# Altium schematic sheet KS-WL-GW-GPRS.SchDoc
size A4; CheckedBy: Fan mingjie; DrawnBy: Jason Huang; Address1: Buliding 5, No.1528; Address2: Gu Mei Rd HQ6; Address3: Shanghai, China; Address4: 20233; DocumentNumber: 1; Revision: 1; SheetNumber: 1; SheetTotal: 2
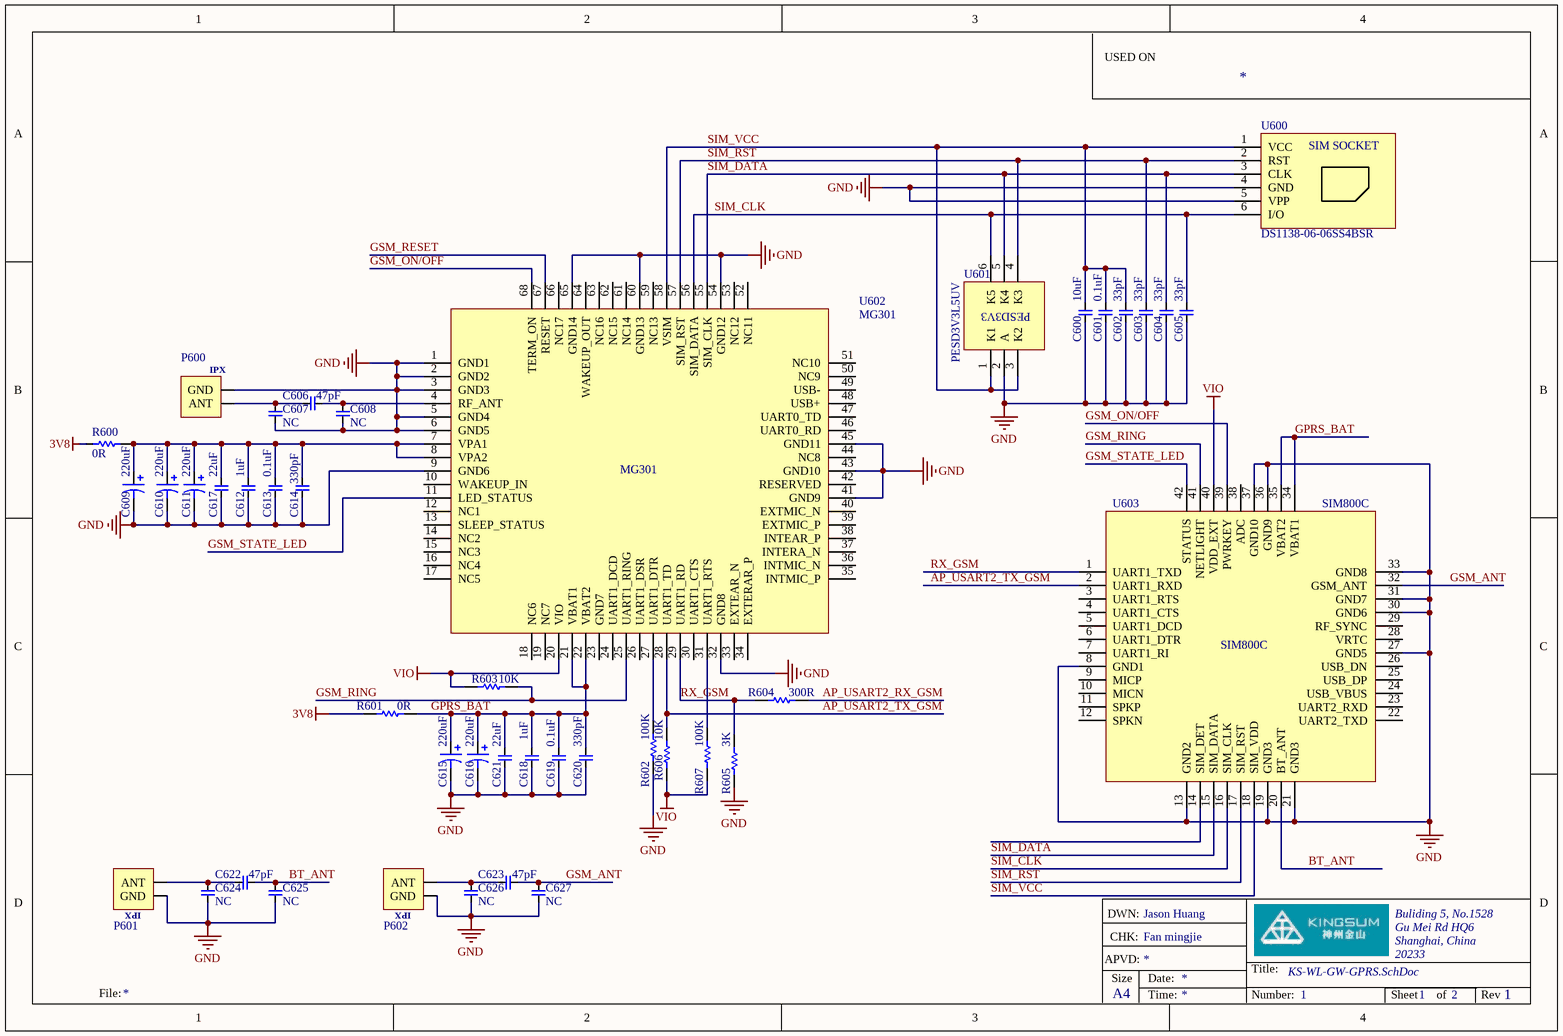
[diagram p0: KS-WL-GW-GPRS.SchDoc]

## Parts
C600  10uF  [C0805]
C601  0.1uF  [0402 CAP]
C602  33pF  [0402 CAP]
C603  33pF  [0402 CAP]
C604  33pF  [0402 CAP]
C605  33pF  [0402 CAP]
C606  47pF  [0402 CAP]
C607  NC  [0402 CAP]
C608  NC  [0402 CAP]
C609  220uF  [LC-CASE-B_3528]
C610  220uF  [LC-CASE-B_3528]
C611  220uF  [LC-CASE-B_3528]
C612  1uF  [C0805]
C613  0.1uF  [0402 CAP]
C614  330pF  [0402 CAP]
C615  220uF  [LC-CASE-B_3528]
C616  220uF  [LC-CASE-B_3528]
C617  22uF  [C1206_L]
C618  1uF  [C0805]
C619  0.1uF  [0402 CAP]
C620  330pF  [0402 CAP]
C621  22uF  [C1206_L]
C622  47pF  [0402 CAP]
C623  47pF  [0402 CAP]
C624  NC  [0402 CAP]
C625  NC  [0402 CAP]
C626  NC  [0402 CAP]
C627  NC  [0402 CAP]
P600  ADE-CONN-RF-IPX  [IPX]  (value not drawn)
P601  ADE-CONN-RF-IPX  [IPX]  (value not drawn)
P602  ADE-CONN-RF-IPX  [IPX]  (value not drawn)
R600  0R  [0805 Res]
R601  0R  [0805 Res]
R602  100K  [0402 Res]
R603  10K  [0402 Res]
R604  300R  [0402 Res]
R605  3K  [0402 Res]
R606  10K  [0402 Res]
R607  100K  [0402 Res]
U600  DS1138-06-06SS4BSR  [SIM Socket]
U601  PESD3V3L5UV  [SOT-666]
U602  MG301  [LCC68]
U603  SIM800C  [SIM800C]

## Nets
3V8: R600.1 R601.1
GND: C600.1 C601.1 C602.1 C603.1 C604.1 C605.1 C607.1 C608.1 C609.2 C610.2 C611.2 C612.1 C613.1 C614.1 C615.2 C616.2 C617.1 C618.1 C619.1 C620.1 C621.1 C624.1 C625.1 C626.1 C627.1 P600.1(GND) P601.1(GND) P602.1(GND) R602.1 R605.1 U600.4(GND) U600.5(VPP) U601.2(A) U602.1(GND1) U602.2(GND2) U602.3(GND3) U602.5(GND4) U602.6(GND5) U602.9(GND6) U602.32(GND8) U602.41(GND9) U602.43(GND10) U602.45(GND11) U602.54(GND12) U602.60(GND13) U602.65(GND14) U603.8(GND1) U603.13(GND2) U603.19(GND3) U603.21(GND3) U603.27(GND5) U603.30(GND6) U603.31(GND7) U603.33(GND8) U603.36(GND9) U603.37(GND10)
VIO: R603.1 R606.2 R607.1 U602.20(VIO) U603.40(VDD_EXT)
AP_USART2_RX_GSM: R604.1
AP_USART2_TX_GSM: R606.1 U602.28(UART1_TD) U603.2(UART1_RXD)
BT_ANT: C622.1 C625.2 U603.20(BT_ANT)
GPRS_BAT: C615.1 C616.1 C618.2 C619.2 C620.2 C621.2 R601.2 U602.21(VBAT1) U602.22(VBAT2) U603.34(VBAT1) U603.35(VBAT2)
GSM_ANT: C623.1 C627.2 U603.32(GSM_ANT)
GSM_ON/OFF: U602.68(TERM_ON) U603.39(PWRKEY)
GSM_RESET: U602.67(RESET)
GSM_RING: R603.2 U602.25(UART1_RING) U603.41(NETLIGHT)
GSM_STATE_LED: U602.11(LED_STATUS) U603.42(STATUS)
RX_GSM: R604.2 R605.2 U602.29(UART1_RD) U603.1(UART1_TXD)
SIM_CLK: C605.2 U600.6(I/O) U601.6(K5) U602.56(SIM_DATA) U603.16(SIM_CLK)
SIM_DATA: C604.2 U600.3(CLK) U601.5(K4) U602.55(SIM_CLK) U603.15(SIM_DATA)
SIM_RST: C603.2 U600.2(RST) U601.4(K3) U602.57(SIM_RST) U603.17(SIM_RST)
SIM_VCC: C600.2 C601.2 C602.2 U600.1(VCC) U601.1(K1) U601.3(K2) U602.58(VSIM) U603.18(SIM_VDD)
NetC606_1: C606.1 C608.2 U602.4(RF_ANT)
NetC606_2: C606.2 C607.2 P600.2(ANT)
NetC609_1: C609.1 C610.1 C611.1 C612.2 C613.2 C614.2 C617.2 R600.2 U602.7(VPA1) U602.8(VPA2)
NetC622_2: C622.2 C624.2 P601.2(ANT)
NetC623_2: C623.2 C626.2 P602.2(ANT)
NetR602_2: R602.2 U602.27(UART1_DTR)
NetR607_2: R607.2 U602.31(UART1_RTS)

Not connected (* = marked no-connect by the designer): U602 10(WAKEUP_IN) 12(NC1) 13(SLEEP_STATUS) 14(NC2) 15(NC3) 16(NC4) 17(NC5) 18(NC6) 19(NC7) 23(GND7) 24(UART1_DCD) 26(UART1_DSR) 30(UART1_CTS) 33(EXTEAR_N) 34(EXTERAR_P) 35(INTMIC_P) 36(INTMIC_N) 37(INTERA_N) 38(INTEAR_P) 39(EXTMIC_P) 40(EXTMIC_N) 42(RESERVED) 44(NC8) 46(UART0_RD) 47(UART0_TD) 48(USB+) 49(USB-) 50(NC9) 51(NC10) 52(NC11) 53(NC12) 59(NC13) 61(NC14) 62(NC15) 63(NC16) 64(WAKEUP_OUT) 66(NC17); U603 3(UART1_RTS) 4(UART1_CTS) 5(UART1_DCD) 6(UART1_DTR) 7(UART1_RI) 9(MICP) 10(MICN) 11(SPKP) 12(SPKN) 14(SIM_DET) 22(UART2_TXD) 23(UART2_RXD) 24(USB_VBUS) 25(USB_DP) 26(USB_DN) 28(VRTC) 29(RF_SYNC) 38(ADC)

## Notes on the sheet
- USED ON
- DWN:
- APVD:
- CHK:
- Size
- Date:
- Title:
- File:
- A4
- Time:
- Number:
- Sheet
- of
- Rev
- (in symbol Kingsum-ESD-PESD3V3L5UV) PESD3V3

## Library data of the parts
C600 = ADE-C0805-10U: Non-polarised capacitor; Part Rev: V; Part Description: CAPACITOR, CERAMIC CHIP, 0805 CASE, SURFACE MOUNT , 10 uF +/-10% 25 V, X5R; Mfr_PN: GRM219R61E475KA73; Manufacturer: MURATA; Tolerance: +/-10%; Volt-Rated: 25 V; Signal Integrity: Cap; Option: 0; TE PN: ADE-C0805-10U; Series: MLCC; RoHS Compliant: YES; Value: 10uF; Package: C0805; SPICE model: CAP; Published: 10/17/2016; Publisher: TE Connectivity; LatestRevisionDate: 04/22/2013; LatestRevisionNote: Production; ComponentLink1Description: Datasheet; ComponentLink1URL: http://engineeringportal.tycoelectronics.com/web/engineering/part-inquiry?PartNo=1-20065-7; ComponentLink3Description: Package; ComponentLink3URL: http://www.murata.com/products/catalog/pdf/c02e.pdf; ComponentLink2Description: Web Page; ComponentLink2URL: http://dmtec.tycoelectronics.com/dmtec/servlet/DocumentLookup?type=Production+Drawing&name=20065&format=PDF; Price: *; Stock: *; Stock Position: *
C601 C613 C619 = ADE-C0402-0.1U: Non-polarised capacitor; Part Rev: V; Part Description: CAPACITOR, CERAMIC CHIP, 0402 CASE, SURFACE MOUNT , 0.1 uF +/-20% 25 V, X7R; Mfr_PN: GRM155R61E104KA87; Manufacturer: MURATA; Tolerance: +/-10%; Volt-Rated: 25 V; Signal Integrity: Cap; Option: 0; TE PN: ADE-C0402-0.1U; Series: MLCC; RoHS Compliant: YES; Value: 0.1uF; Package: 0402; Footprint: 0402; SPICE model: CAP; Published: 10/14/2016; Publisher: TE Connectivity; LatestRevisionDate: 04/22/2013; LatestRevisionNote: Production; ComponentLink1Description: Datasheet; ComponentLink1URL: http://engineeringportal.tycoelectronics.com/web/engineering/part-inquiry?PartNo=1-20065-7; ComponentLink3Description: Package; ComponentLink3URL: http://www.murata.com/products/catalog/pdf/c02e.pdf; ComponentLink2Description: Web Page; ComponentLink2URL: http://dmtec.tycoelectronics.com/dmtec/servlet/DocumentLookup?type=Production+Drawing&name=20065&format=PDF; Manufacturer2: Yageo; Mfr_PN2: CC0402KRX7R8BB104
C602-C605 = ADE-C0402-33P: Non-polarised capacitor; Part Rev: V; Part Description: CAPACITOR, CERAMIC CHIP, 0402 CASE, SURFACE MOUNT , 33 pF +/-5% 50 V, C0G; Mfr_PN: GRM1555C1H330JA01; Manufacturer: MURATA; Tolerance: +/-5%; Volt-Rated: 50 V; Signal Integrity: Cap; Option: 0; TE PN: ADE-C0402-33P; Series: MLCC; RoHS Compliant: YES; Value: 33pF; Package: 0402; Footprint: 0402; SPICE model: CAP; Published: 10/17/2016; Publisher: TE Connectivity; LatestRevisionDate: 04/22/2013; LatestRevisionNote: Production; ComponentLink1Description: Datasheet; ComponentLink1URL: http://engineeringportal.tycoelectronics.com/web/engineering/part-inquiry?PartNo=1-20065-7; ComponentLink3Description: Package; ComponentLink3URL: http://www.murata.com/products/catalog/pdf/c02e.pdf; ComponentLink2Description: Web Page; ComponentLink2URL: http://dmtec.tycoelectronics.com/dmtec/servlet/DocumentLookup?type=Production+Drawing&name=20065&format=PDF; Price: *; Stock: *; Stock Position: *
C606 C622 C623 = ADE-C0402-47P: Non-polarised capacitor; Part Rev: V; Part Description: CAPACITOR, CERAMIC CHIP, 0402 CASE, SURFACE MOUNT , 47 pF +/-5% 50 V, C0G; Mfr_PN: GRM1555C1H470JA01; Manufacturer: MURATA; Tolerance: +/-5%; Volt-Rated: 50 V; Signal Integrity: Cap; Option: 0; TE PN: ADE-C0402-47P; Series: MLCC; RoHS Compliant: YES; Value: 47pF; Package: 0402; Footprint: 0402; SPICE model: CAP; Published: 10/17/2016; Publisher: TE Connectivity; LatestRevisionDate: 04/22/2013; LatestRevisionNote: Production; ComponentLink1Description: Datasheet; ComponentLink1URL: http://engineeringportal.tycoelectronics.com/web/engineering/part-inquiry?PartNo=1-20065-7; ComponentLink3Description: Package; ComponentLink3URL: http://www.murata.com/products/catalog/pdf/c02e.pdf; ComponentLink2Description: Web Page; ComponentLink2URL: http://dmtec.tycoelectronics.com/dmtec/servlet/DocumentLookup?type=Production+Drawing&name=20065&format=PDF; Price: *; Stock: *; Stock Position: *
C607 C608 C624-C627 = ADE-C0402-NC: Non-polarised capacitor; Part Rev: V; Part Description: CAPACITOR, CERAMIC CHIP, 0402 CASE, SURFACE MOUNT ,NC; Manufacturer: MURATA; Signal Integrity: Cap; Option: 0; TE PN: ADE-C0402-NC; Series: MLCC; RoHS Compliant: YES; Value: NC; Tolerance: -; Package: 0402; Volt-Rated: -; Footprint: 0402; SPICE model: CAP; Published: 10/14/2016; Publisher: TE Connectivity; LatestRevisionDate: 11/29/2012; LatestRevisionNote: Production; ComponentLink1Description: Datasheet; ComponentLink1URL: http://engineeringportal.tycoelectronics.com/web/engineering/part-inquiry?PartNo=1-20065-7; Mfr_PN: NC; ComponentLink3Description: Package; ComponentLink3URL: http://www.murata.com/products/catalog/pdf/c02e.pdf; ComponentLink2Description: Web Page; ComponentLink2URL: http://dmtec.tycoelectronics.com/dmtec/servlet/DocumentLookup?type=Production+Drawing&name=20065&format=PDF
C609-C611 C615 C616 = Kingsum-Cap-Tan-220uF-6V3: CAP,  Tan, 100uF 6V3 10%  105c, 4-10Khr Life, Hi Ripple, Low Imped; Part Rev: V; Manufacturer: Sunlord; TE PN: ADE-Cap-Electrolytic-25V-220uF; Tolerance: +-20%; Designator: TC212B227M006A; Option: 0; Series: Electrolytic; Part Description: CAP,  Tan, 100uF 6V3 10%  105c, 4-10Khr Life, Hi Ripple, Low Imped; RoHS Compliant: YES; Value: 220uF; Package: 3528; Volt-Rated: 6V3; Footprint: 3528; SPICE model: CAP; Signal Integrity: Cap; Published: 10/17/2016; Publisher: TE Connectivity; LatestRevisionNote: Production; ComponentLink1Description: Datasheet; ComponentLink1URL: http://www.rubycon.co.jp/cn/catalog/capacitors.html; Mfr_PN: TC212B227M006A; ComponentLink3Description: Procurement; ComponentLink3URL: http://www.szlcsc.com/product/details_112141.html; ComponentLink2Description: Web Page
C612 C618 = ADE-C0805-1uF: Non-polarised capacitor; Part Rev: V; Part Description: CAPACITOR, CERAMIC CHIP, 0805 CASE, SURFACE MOUNT , 1uF +/-10% 50 V, X7R; Mfr_PN: CC0805K_X7R9BB106; Manufacturer: Yageo; Tolerance: +/-10%; Volt-Rated: 50V; Signal Integrity: Cap; Option: 0; TE PN: ADE-C0805-1uF; Series: MLCC; RoHS Compliant: YES; Value: 1uF; Package: C0805; SPICE model: CAP; Published: 10/17/2016; Publisher: TE Connectivity; LatestRevisionDate: 04/22/2013; LatestRevisionNote: Production; ComponentLink1Description: Datasheet; ComponentLink3Description: Package; ComponentLink3URL: http://www.yageo.com/documents/recent/UPY-GPHC_X7R_6.3V-to-50V_9.pdf; ComponentLink2Description: Web Page; Price: *; Stock: *; Stock Position: *
C614 C620 = ADE-C0402-330P: Non-polarised capacitor; Part Rev: V; Part Description: CAPACITOR, CERAMIC CHIP, 0402 CASE, SURFACE MOUNT , 330 pF +/-5% 50 V, C0G; Mfr_PN: GRM1555C1H331JA01; Manufacturer: MURATA; Tolerance: +/-5%; Volt-Rated: 50 V; Signal Integrity: Cap; Option: 0; TE PN: ADE-C0402-330P; Series: MLCC; RoHS Compliant: YES; Value: 330pF; Package: 0402; Footprint: 0402; SPICE model: CAP; Published: 10/17/2016; Publisher: TE Connectivity; LatestRevisionDate: 04/22/2013; LatestRevisionNote: Production; ComponentLink1Description: Datasheet; ComponentLink1URL: http://engineeringportal.tycoelectronics.com/web/engineering/part-inquiry?PartNo=1-20065-7; ComponentLink3Description: Package; ComponentLink3URL: http://www.murata.com/products/catalog/pdf/c02e.pdf; ComponentLink2Description: Web Page; ComponentLink2URL: http://dmtec.tycoelectronics.com/dmtec/servlet/DocumentLookup?type=Production+Drawing&name=20065&format=PDF; Price: *; Stock: *; Stock Position: *
C617 C621 = ADE-C1206-22U: Non-polarised capacitor; Part Rev: V; Part Description: CAPACITOR, CERAMIC CHIP, 1206 CASE, SURFACE MOUNT , 22uF +/-20% 25V, X5R; Mfr_PN: GRM31CR61E226ME15; Manufacturer: MURATA; Tolerance: +/-20%; Volt-Rated: 25V; Signal Integrity: Cap; Option: 0; TE PN: ADE-C1206-22U; Series: MLCC; RoHS Compliant: YES; Value: 22uF; Package: C1206_L; Footprint: C1206; SPICE model: CAP; Published: 10/17/2016; Publisher: TE Connectivity; LatestRevisionDate: 08/05/2013; LatestRevisionNote: Production; ComponentLink1Description: Datasheet; ComponentLink1URL: http://www.murata.com/products/catalog/pdf/c02e.pdf; ComponentLink3Description: Package; ComponentLink2Description: Web Page
P600-P602 = ADE-CONN-RF-IPX: 5IPX 0Ohm,MCRF,PCB Vertical Jack Receptacle, SMT,1.25 mm Height; Mfr_PN: 734120110; Part Description: IPX 50Ohm,MCRF,PCB Vertical Jack Receptacle, SMT,1.25 mm Height; Manufacturer: Molex; CompType: Connector; Rule: PcbType=ProtelPcb; Option: 0; LatestRevisionDate: *; LatestRevisionNote: Re-released for DXP Platform.; Publisher: TE Connectivity; PinCount: 2; Published: 10/20/2016; Series: Connector; TE PN: ADE-CONN-RF-IPX; Voltage: *; Current: *; ComponentLink2Description: Web Page; ComponentLink1Description: Datasheet; ComponentLink3Description: Package
R600 R601 = ADE-R0805-0R: RESISTOR  Normal; Part Rev: A; Part Description: RESISTOR, CHIP, THICK FILM, SURGE CURRENT, 0805 CASE, 1/8 W, 150V, 1 A , 0 OHMS +/-5%, +/-200 PPM/DEG C, TIN TERMINATION; Mfr_PN: RC0805JR-7D0RL; Manufacturer: YAGEO; Precision: +/-5%; Volt-Rated: 150 V; Power-Rated: 1/8 W; Signal Integrity: Res; Option: 0; TE_PN: ADE-R0805-0R; ComponentLink2Description: Web Page; ComponentLink2URL: http://dmtec.tycoelectronics.com/dmtec/servlet/DocumentLookup?type=Production+Drawing&name=1900457&format=PDF; Series: General Purpose Chip Resistors; ComponentLink3URL: http://www.yageo.com/documents/recent/PYu-RC0402_51_RoHS_L_6_r.pdf; RoHS Compliant: YES; Value: 0R; Package: 0805; Footprint: kOA2A-0805; SPICE model: RESISTOR; Published: 25/04/2013; Publisher: TE Connectivity; LatestRevisionDate: 11/15/2012; LatestRevisionNote: Production; ComponentLink1URL: http://engineeringportal.tycoelectronics.com/web/engineering/part-inquiry?PartNo=1900457-1; ComponentLink1Description: Datasheet; ComponentLink3Description: Package
R602 R607 = ADE-R0402-100K: RESISTOR  Normal; Part Rev: A; Part Description: RESISTOR, CHIP, THICK FILM, SURGE CURRENT, 0402 CASE, 1/16 W, 50 V , 100K OHMS +/-5%, +/-100 PPM/DEG C, TIN TERMINATION; Mfr_PN: RC0402JR-7D100KL; Manufacturer: YAGEO; Precision: +/-5%; Volt-Rated: 50 V; Power-Rated: 1/16 W; Signal Integrity: Res; Option: 0; TE_PN: ADE-R0402-100K; ComponentLink2Description: Web Page; ComponentLink2URL: http://dmtec.tycoelectronics.com/dmtec/servlet/DocumentLookup?type=Production+Drawing&name=1900457&format=PDF; Series: General Purpose Chip Resistors; ComponentLink3URL: http://www.yageo.com/documents/recent/PYu-RC0402_51_RoHS_L_6_r.pdf; RoHS Compliant: YES; Value: 100K; Package: 0402; Footprint: kOA1E-0402; SPICE model: RESISTOR; Published: 27/03/2014; Publisher: TE Connectivity; LatestRevisionDate: 25/04/2013; LatestRevisionNote: Production; ComponentLink1URL: http://engineeringportal.tycoelectronics.com/web/engineering/part-inquiry?PartNo=1900457-1; ComponentLink1Description: Datasheet; ComponentLink3Description: Package
R603 R606 = ADE-R0402-10K: RESISTOR  Normal; Part Rev: A; Part Description: RESISTOR, CHIP, THICK FILM, SURGE CURRENT, 0402 CASE, 1/16 W, 50 V , 10K OHMS +/-5%, +/-100 PPM/DEG C, TIN TERMINATION; Mfr_PN: RC0402JR-7D10KL; Manufacturer: YAGEO; Precision: +/-5%; Volt-Rated: 50 V; Power-Rated: 1/16 W; Signal Integrity: Res; Option: 0; TE_PN: ADE-R0402-10K; ComponentLink2Description: Web Page; ComponentLink2URL: http://dmtec.tycoelectronics.com/dmtec/servlet/DocumentLookup?type=Production+Drawing&name=1900457&format=PDF; Series: General Purpose Chip Resistors; ComponentLink3URL: http://www.yageo.com/documents/recent/PYu-RC0402_51_RoHS_L_6_r.pdf; RoHS Compliant: YES; Value: 10K; Package: 0402; Footprint: kOA1E-0402; SPICE model: RESISTOR; Designator: RC0402JR-7D10KL; Published: 25/04/2013; Publisher: TE Connectivity; LatestRevisionDate: 25/04/2013; LatestRevisionNote: Production; ComponentLink1URL: http://engineeringportal.tycoelectronics.com/web/engineering/part-inquiry?PartNo=1900457-1; ComponentLink1Description: Datasheet; ComponentLink3Description: Package
R604 = ADE-R0402-300R: RESISTOR  Normal; Part Rev: A; Part Description: RESISTOR, CHIP, THICK FILM, SURGE CURRENT, 0402 CASE, 1/16 W, 50 V , 150R OHMS +/-5%, +/-100 PPM/DEG C, TIN TERMINATION; Mfr_PN: RC0402JR-7D300RL; Manufacturer: YAGEO; Precision: +/-5%; Volt-Rated: 50 V; Power-Rated: 1/16 W; Signal Integrity: Res; Option: 0; TE_PN: ADE-R0402-300R; ComponentLink2Description: Web Page; ComponentLink2URL: http://dmtec.tycoelectronics.com/dmtec/servlet/DocumentLookup?type=Production+Drawing&name=1900457&format=PDF; Series: General Purpose Chip Resistors; ComponentLink3URL: http://www.yageo.com/documents/recent/PYu-RC0402_51_RoHS_L_6_r.pdf; RoHS Compliant: YES; Value: 300R; Package: 0402; Footprint: kOA1E-0402; SPICE model: RESISTOR; Published: 25/04/2013; Publisher: TE Connectivity; LatestRevisionDate: 25/04/2013; LatestRevisionNote: Production; ComponentLink1URL: http://engineeringportal.tycoelectronics.com/web/engineering/part-inquiry?PartNo=1900457-1; ComponentLink1Description: Datasheet; ComponentLink3Description: Package
R605 = ADE-R0402-3K: RESISTOR  Normal; Part Rev: A; Part Description: RESISTOR, CHIP, THICK FILM, SURGE CURRENT, 0402 CASE, 1/16 W, 50 V , 2K7 OHMS +/-5%, +/-100 PPM/DEG C, TIN TERMINATION; Mfr_PN: RC0402JR-7D3KL; Manufacturer: YAGEO; Precision: +/-5%; Volt-Rated: 50 V; Power-Rated: 1/16 W; Signal Integrity: Res; Option: 0; TE_PN: ADE-R0402-3K; ComponentLink2Description: Web Page; ComponentLink2URL: http://dmtec.tycoelectronics.com/dmtec/servlet/DocumentLookup?type=Production+Drawing&name=1900457&format=PDF; Series: General Purpose Chip Resistors; ComponentLink3URL: http://www.yageo.com/documents/recent/PYu-RC0402_51_RoHS_L_6_r.pdf; RoHS Compliant: YES; Value: 3K; Package: 0402; Footprint: kOA1E-0402; SPICE model: RESISTOR; Designator: RC0402JR-7D3KL; Published: 25/04/2013; Publisher: TE Connectivity; LatestRevisionDate: 11/15/2012; LatestRevisionNote: Production; ComponentLink1URL: http://engineeringportal.tycoelectronics.com/web/engineering/part-inquiry?PartNo=1900457-1; ComponentLink1Description: Datasheet; ComponentLink3Description: Package
U600 = kingsum-Socket-SIM: SIM SOCKET; Manufacturer: CONNFLY; Option: 0; Tmp Range: -40 to 105; Publisher: FMJ; ComponentLink1Description: Datasheet; ComponentLink1URL: Datasheet/SOCKET; ComponentLink2Description: Web Page; ComponentLink3Description: Procurement; ComponentLink3URL: http://www.szlcsc.com/product/details_97309.html; Code_IPC: *; Code_JEITA: *; LatestRevisionNote: PRODUCTION; Mfr_PN: DS1138-06-06SS4BSR; Part Rev: *; Published: 10/14/2016; RoHS Compliant: YES; Kingsum PN: kingsum-Socket-SIM; Part Description: SIM SOCKET; Price: 1; Stock: *; Stock Position: *
U601 = Kingsum-ESD-PESD3V3L5UV: Low capacitance 5-fold ESD protection diode arrays in SOT666 package; Manufacturer: NXP; Option: 0; Tmp Range: -65 to 150; Publisher: FMJ; ComponentLink1Description: Datasheet; ComponentLink1URL: Datasheet/ESD; ComponentLink2Description: Web Page; ComponentLink3Description: Procurement; ComponentLink3URL: http://www.szlcsc.com/product/details_8084.html; Code_IPC: *; Code_JEITA: *; Footprint: SOT666; LatestRevisionNote: PRODUCTION; Mfr_PN: PESD3V3L5UV; Package: SOT666; Part Rev: *; Published: 10/14/2016; RoHS Compliant: YES; Kingsum PN: Kingsum-ESD-PESD3V3L5UV; Part Description: Low capacitance 5-fold ESD protection diode arrays in SOT666 package; Price: 1; Stock: *; Stock Position: *
U602 = Kingsum-GPRS-MG301: GSM/GPRS MODULE; Manufacturer: HUAWEI; Option: 0; Tmp Range: -20 to 70; Publisher: FMJ; ComponentLink1Description: Datasheet; ComponentLink1URL: Datasheet/GPRS; ComponentLink2Description: Web Page; ComponentLink3Description: Procurement; ComponentLink3URL: https://detail.tmall.com/item.htm?spm=a220m.1000858.1000725.11.d811797m2MLPr&id=36628413853&user_id=1679662746&cat_id=2&is_b=1&rn=b77b295f5ab337a1fa1d3dde7c4bdff7; Code_IPC: *; Code_JEITA: *; Footprint: MG301; LatestRevisionNote: PRODUCTION; Mfr_PN: MG301; Package: MG301; Part Rev: *; Published: 10/14/2016; RoHS Compliant: YES; Kingsum PN: Kingsum-GPRS-MG301; Part Description: GSM/GPRS MODULE; Price: 45; Stock: *; Stock Position: *
U603 = Kingsum-GPRS-SIM800C: GSM/GPRS MODULE; Manufacturer: HUAWEI; Option: 0; Tmp Range: -20 to 70; Publisher: FMJ; ComponentLink1Description: Datasheet; ComponentLink1URL: Datasheet/GPRS; ComponentLink2Description: Web Page; ComponentLink3Description: Procurement; ComponentLink3URL: http://www.szlcsc.com/product/details_70232.html; Code_IPC: *; Code_JEITA: *; LatestRevisionNote: PRODUCTION; Mfr_PN: SIM800C; Package: SIM800C; Part Rev: *; Published: 10/14/2016; RoHS Compliant: YES; Kingsum PN: Kingsum-GPRS-SIM800C; Part Description: GSM/GPRS MODULE; Price: 45; Stock: *; Stock Position: *